# Altium schematic sheet FET.SchDoc (part 2 of 2)
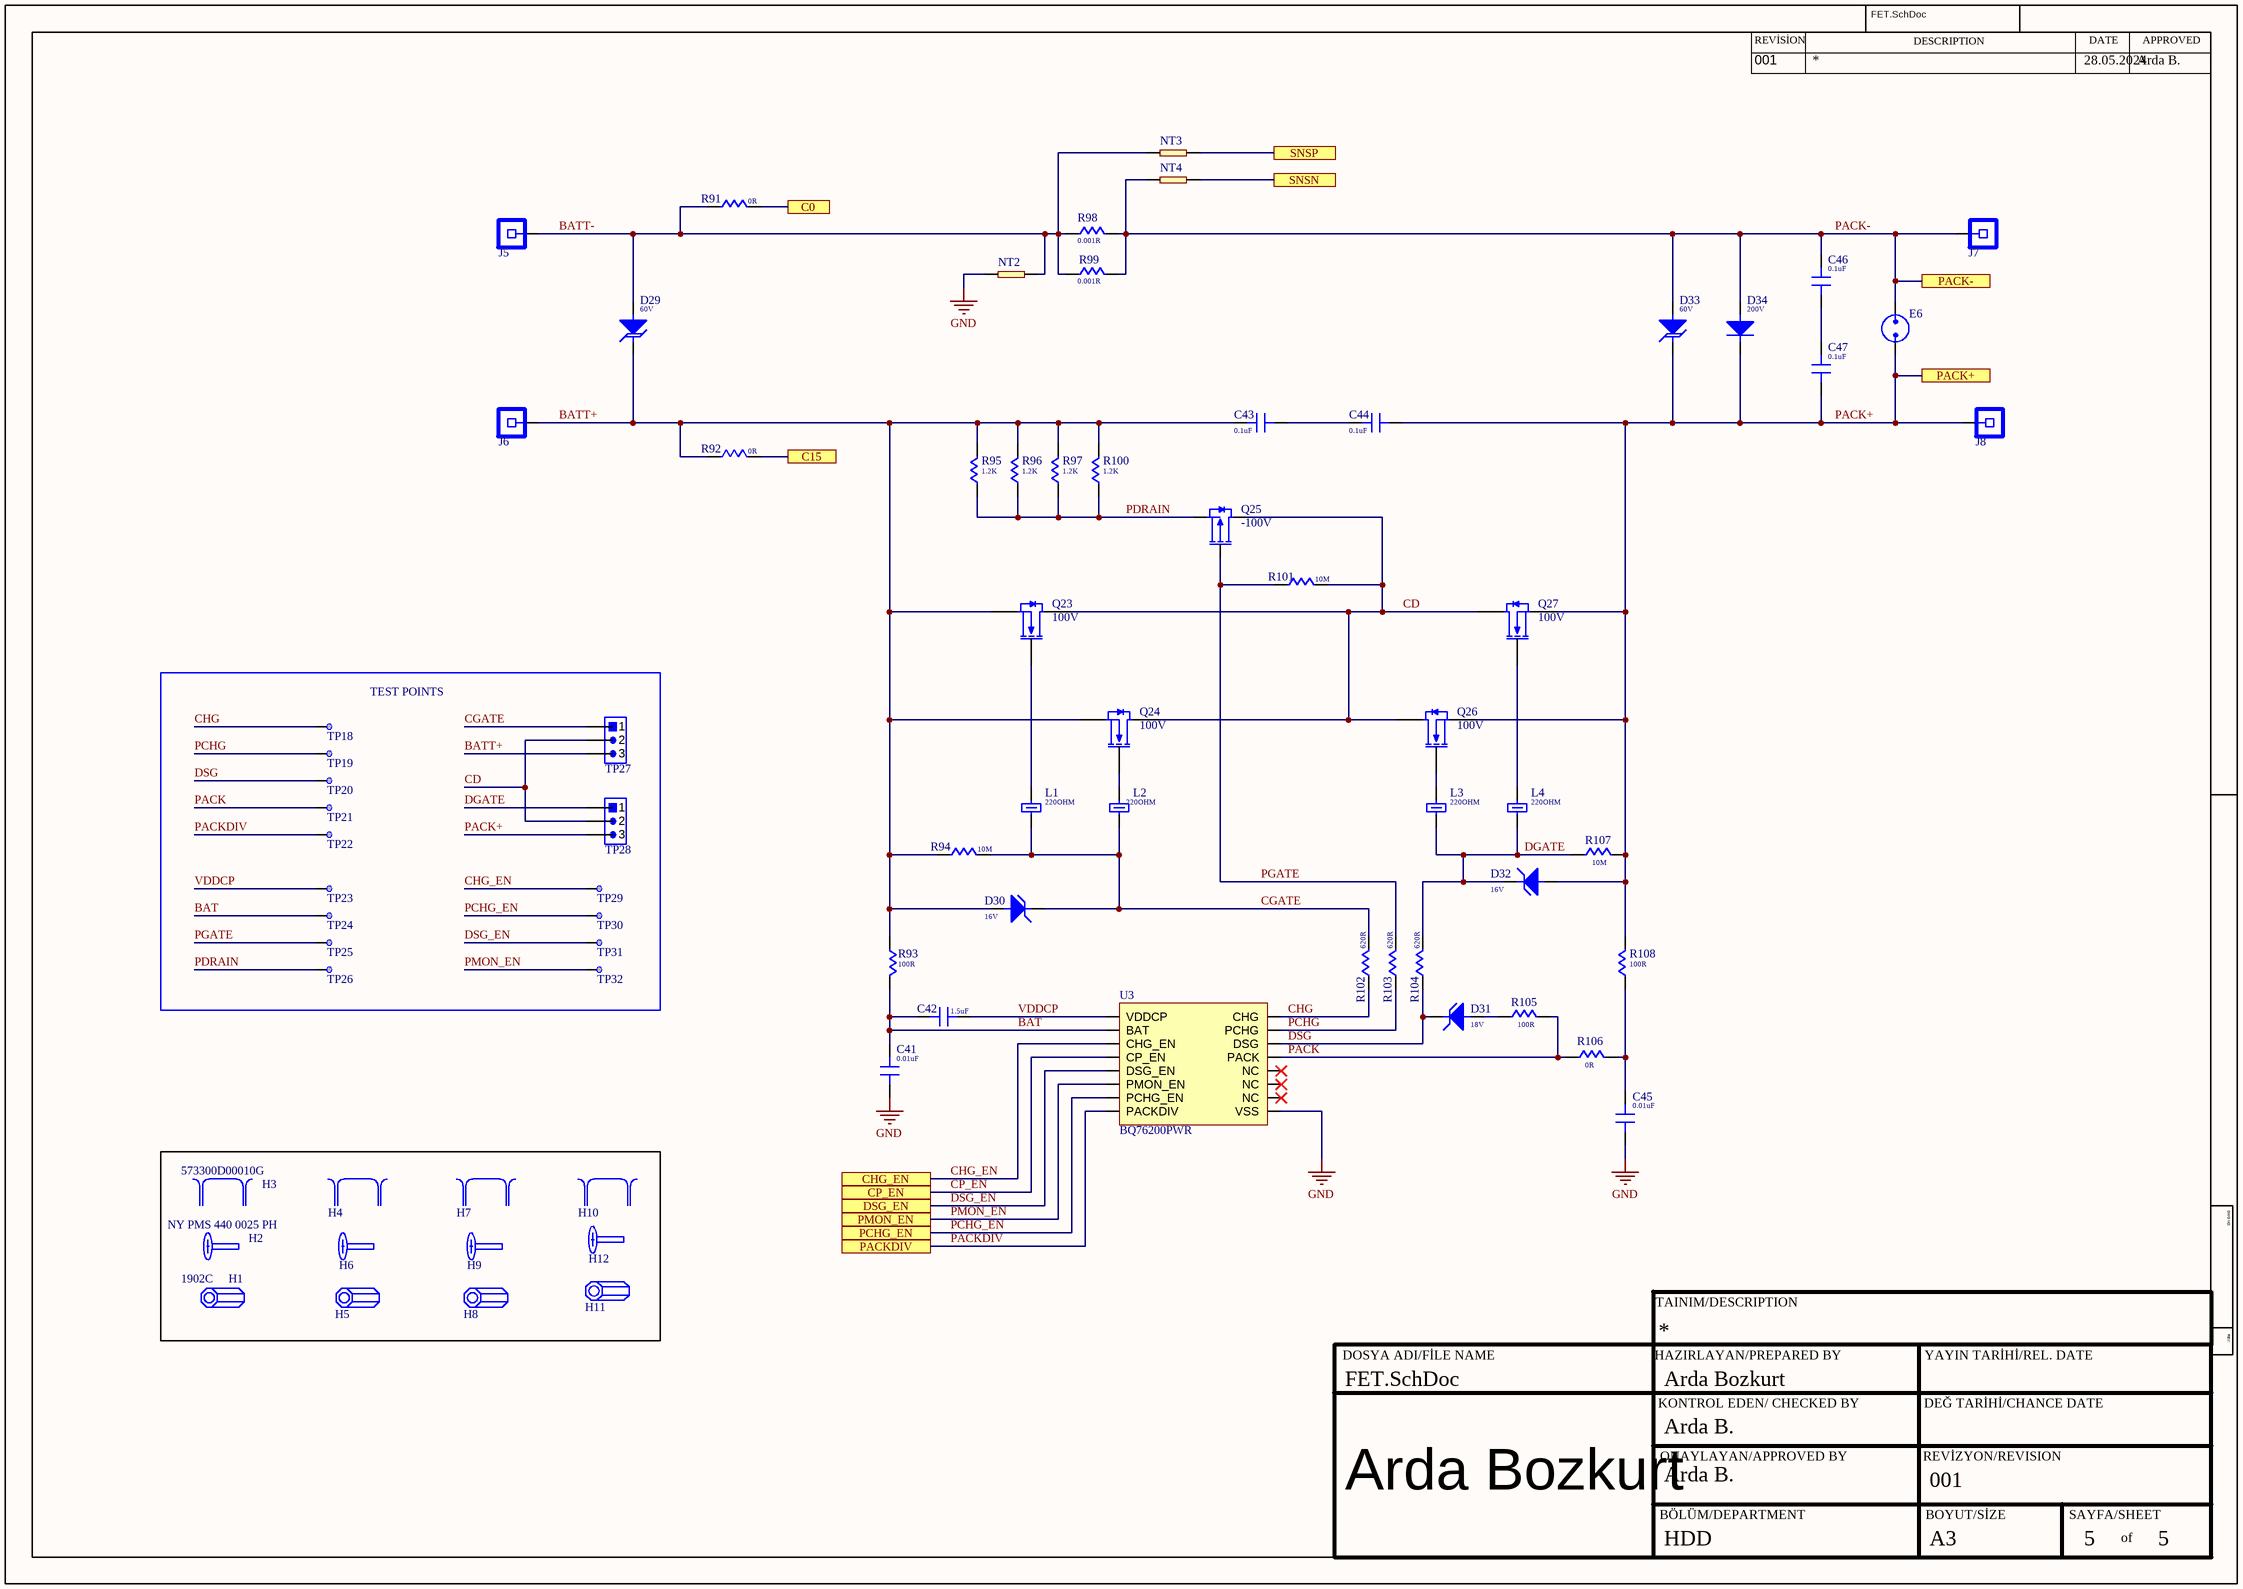
[diagram p1: FET.SchDoc]

## Library data of the parts
C41 C45 = C_0.01uF_0805_100V: Cap Cer 10000PF 100V X7R 0805; Manufacturer: Kyocera AVX; Supplier: Mouser; Supplier Part Number: 581-KGM21NR72A103KT; Manufacturer Part Number: KGM21NR72A103KT; RoHS: No; Category: Ceramic Capacitors; Stock: 110390; Pricing: 1=0,11, 10=0,044, 50=0,044, 100=0,026, 1000=0,019, 10000=0,016 (USD)
C42 = C_1.5uF_0805_25V: 0805 1.5 uF 25 V ±10% Tolerance X7R SMT Multilayer Ceramic Capacitor; Manufacturer: Murata; Voltage Rating: 25V; Supplier: Mouser; Supplier Part Number: 81-GRM21BR71E155KA8L; Manufacturer Part Number: GRM21BR71E155KA88L; RoHS: Yes; Category: Ceramic Capacitors; Stock: 48189; Pricing: 1=0,49, 10=0,245, 50=0,245, 100=0,157, 1000=0,129, 10000=0,085 (USD); Mounting Technology: Surface Mount; Case/Package: 0805; Case Code (Imperial): 0805; Case Code (Metric): 2012; Min Operating Temperature: -55°C; Max Operating Temperature: 125°C; Tolerance: 10%; Dielectric: X7R; Packaging: Tape and Reel; Voltage Rating (DC): 25V; Package Quantity: 1; Termination: SMD/SMT; Voltage: 25V; Series: GRM; Construction: Flat; Length: 2mm; Width: 0.049inch; Height: 1.25mm; Thickness: 0.053inch; Depth: 1.25mm; Radiation Hardening: No; Lead Free: Lead Free; RoHS Compliant: Yes; ComponentLink1URL: https://datasheet.ciiva.com/172/product-172215.pdf?src-supplier=Digikey; ComponentLink1Description: https://datasheet.ciiva.com/172/product-172215.pdf?src-supplier=Digikey; ComponentLink2URL: https://datasheet.ciiva.com/172/product-172214.pdf?src-supplier=Digikey; ComponentLink2Description: https://datasheet.ciiva.com/172/product-172214.pdf?src-supplier=Digikey; ComponentLink3URL: https://datasheet.ciiva.com/3778/131grm21br71e155ka8823-3778948.pdf?src-supplier=Arrow+Electronics; ComponentLink3Description: https://datasheet.ciiva.com/3778/131grm21br71e155ka8823-3778948.pdf?src-supplier=Arrow+Electronics; ComponentLink4URL: https://datasheet.ciiva.com/29534/partnumbering-e-01-29534267.pdf?src-supplier=Digikey; ComponentLink4Description: https://datasheet.ciiva.com/29534/partnumbering-e-01-29534267.pdf?src-supplier=Digikey; ComponentLink5URL: https://datasheet.ciiva.com/11615/product-11615739.pdf?src-supplier=Avnet; ComponentLink5Description: https://datasheet.ciiva.com/11615/product-11615739.pdf?src-supplier=Avnet; ComponentLink6URL: https://datasheet.ciiva.com/16219/l0005e-16219125.pdf?src-supplier=Future+Electronics; ComponentLink6Description: https://datasheet.ciiva.com/16219/l0005e-16219125.pdf?src-supplier=Future+Electronics
C43 C44 C46 C47 = C_0.1uF_0603_100V: Multilayer Ceramic Capacitor, 0.1 uF, 100 V, ± 10%, X7R, 0603 [1608 Metric]; Manufacturer: Murata; Voltage Rating: 100V; Supplier: Mouser; Supplier Part Number: 81-GRM188R72A104KA35; Manufacturer Part Number: GRM188R72A104KA35D; RoHS: Yes; Category: Ceramic Capacitors; Stock: 809956; Pricing: 1=0,2, 10=0,086, 50=0,086, 100=0,05, 1000=0,043, 10000=0,035 (USD); Mounting Technology: Surface Mount; Case/Package: 0603; Weight: 0.000222oz; Case Code (Imperial): 0603; Case Code (Metric): 1608; Material: Ceramic; Min Operating Temperature: -55°C; Max Operating Temperature: 125°C; Tolerance: 10%; Dielectric: X7R; Voltage Rating (DC): 100V; Packaging: Tape and Reel; Package Quantity: 1; Termination: SMD/SMT; Voltage: 100V; Series: GRM; Construction: Flat; Length: 1.6mm; Width: 0.031inch; Height: 0.8mm; Thickness: 0.035inch; Depth: 0.8mm; Size: 0.8mm; Radiation Hardening: No; Reach SVHC Compliant: No; RoHS Compliant: Yes; Lead Free: 5697LeadFree; ComponentLink1URL: https://datasheet.ciiva.com/18100/getdatasheetpartid-27818-18100710.pdf?src-supplier=Verical; ComponentLink1Description: https://datasheet.ciiva.com/18100/getdatasheetpartid-27818-18100710.pdf?src-supplier=Verical; ComponentLink2URL: https://datasheet.ciiva.com/22703/1747473-22703345.pdf?src-supplier=Element14; ComponentLink2Description: https://datasheet.ciiva.com/22703/1747473-22703345.pdf?src-supplier=Element14; ComponentLink3URL: https://datasheet.ciiva.com/34302/1857815-34302863.pdf?src-supplier=Jameco; ComponentLink3Description: https://datasheet.ciiva.com/34302/1857815-34302863.pdf?src-supplier=Jameco; ComponentLink4URL: https://datasheet.ciiva.com/11787/0900766b80ef921d-11787064.pdf?src-supplier=Rs; ComponentLink4Description: https://datasheet.ciiva.com/11787/0900766b80ef921d-11787064.pdf?src-supplier=Rs; ComponentLink5URL: https://datasheet.ciiva.com/29201/451984-da-01-en-vs-kondensator-0603-29201725.pdf?src-supplier=Conrad; ComponentLink5Description: https://datasheet.ciiva.com/29201/451984-da-01-en-vs-kondensator-0603-29201725.pdf?src-supplier=Conrad; ComponentLink6URL: https://datasheet.ciiva.com/7937/1747473-7937676.pdf?src-supplier=Element14; ComponentLink6Description: https://datasheet.ciiva.com/7937/1747473-7937676.pdf?src-supplier=Element14; ComponentLink7URL: https://datasheet.ciiva.com/135/partnumbering-e-01-135140.pdf?src-supplier=Digikey; ComponentLink7Description: https://datasheet.ciiva.com/135/partnumbering-e-01-135140.pdf?src-supplier=Digikey; ComponentLink8URL: https://datasheet.ciiva.com/135/partnumbering-e-01-135139.pdf?src-supplier=Digikey; ComponentLink8Description: https://datasheet.ciiva.com/135/partnumbering-e-01-135139.pdf?src-supplier=Digikey; ComponentLink9URL: https://datasheet.ciiva.com/135/partnumbering-e-01-135141.pdf?src-supplier=Digikey; ComponentLink9Description: https://datasheet.ciiva.com/135/partnumbering-e-01-135141.pdf?src-supplier=Digikey; ComponentLink10URL: https://datasheet.ciiva.com/16382/product-16382965.pdf?src-supplier=Future+Electronics; ComponentLink10Description: https://datasheet.ciiva.com/16382/product-16382965.pdf?src-supplier=Future+Electronics
D29 D33 = D_TVS_60V-SMC: Diode TVS Single Uni-Dir 6V 1.5KW 2-Pin DO-214AB; Manufacturer: Littelfuse; Manufacturer Part Number: SMCJ6.0A; Direction: Unidirectional; Min Breakdown Voltage: 6.67V; Peak Pulse Current: 145.7A; Test Current: 10mA; Breakdown Voltage: 66.7V; Max Breakdown Voltage: 7.37V; Max Power Dissipation: 6.5W; Max Surge Current: 15.5A; Clamping Voltage: 96.8V; Number of Channels: 1; Leakage Current: 800uA; Clamping Voltage-Max: 10.3V; Power Line Protection: No; Diode Type: ZENER; Supplier: Farnell; Supplier Part Number: 4060218; RoHS: Yes; Category: TVS Diodes; Stock: 2678; Pricing: 1=0,5, 10=0,428, 100=0,298, 500=0,233, 1000=0,22, 5000=0,206 (EUR); Mounting Technology: Surface Mount; Case/Package: DO-214AB; Pins: 2; Weight: 0.007408oz; Min Operating Temperature: -55°C; Max Operating Temperature: 150°C; Packaging: Tape and Reel; Reverse Standoff Voltage: 6V; Peak Pulse Power: 1.5kW; Polarity: Unidirectional; Power Dissipation: 1.5kW; Termination: SMD/SMT; Voltage Rating (DC): 6V; Package Quantity: 3000; Operating Supply Voltage: 6V; Series: SMCJ; Reverse Breakdown Voltage: 6.67V; Number of Unidirectional Channels: 1; Number of Elements: 1; Length: 8.13mm; Width: 6.22mm; Height: 2.62mm; Reach SVHC Compliant: No; Lead Free: Lead Free; RoHS Compliant: Yes; ComponentLink1URL: https://datasheet.ciiva.com/18549/littelfuse-tvs-diode-smcj-datasheet-pdf-18549239.pdf?src-supplier=Digikey; ComponentLink1Description: https://datasheet.ciiva.com/18549/littelfuse-tvs-diode-smcj-datasheet-pdf-18549239.pdf?src-supplier=Digikey; ComponentLink2URL: https://datasheet.ciiva.com/22685/607636-22685525.pdf?src-supplier=Element14; ComponentLink2Description: https://datasheet.ciiva.com/22685/607636-22685525.pdf?src-supplier=Element14; ComponentLink3URL: https://datasheet.ciiva.com/16215/littelfuse-tvs-diode-smcj-16215483.pdf?src-supplier=Future+Electronics; ComponentLink3Description: https://datasheet.ciiva.com/16215/littelfuse-tvs-diode-smcj-16215483.pdf?src-supplier=Future+Electronics; ComponentLink4URL: https://datasheet.ciiva.com/332/littelfuse-tvs-diode-smcj-datasheet-pdf-332130.pdf?src-supplier=Digikey; ComponentLink4Description: https://datasheet.ciiva.com/332/littelfuse-tvs-diode-smcj-datasheet-pdf-332130.pdf?src-supplier=Digikey; ComponentLink5URL: https://datasheet.ciiva.com/332/littelfuse-tvs-diode-smcj-datasheet-pdf-332131.pdf?src-supplier=Digikey; ComponentLink5Description: https://datasheet.ciiva.com/332/littelfuse-tvs-diode-smcj-datasheet-pdf-332131.pdf?src-supplier=Digikey; ComponentLink6URL: https://datasheet.ciiva.com/332/littelfuse-tvs-diode-smcj-datasheet-pdf-332129.pdf?src-supplier=Digikey; ComponentLink6Description: https://datasheet.ciiva.com/332/littelfuse-tvs-diode-smcj-datasheet-pdf-332129.pdf?src-supplier=Digikey; ComponentLink7URL: https://datasheet.ciiva.com/332/littelfuse-tvs-diode-smcj-datasheet-pdf-332202.pdf?src-supplier=Digikey; ComponentLink7Description: https://datasheet.ciiva.com/332/littelfuse-tvs-diode-smcj-datasheet-pdf-332202.pdf?src-supplier=Digikey; ComponentLink8URL: https://datasheet.ciiva.com/332/littelfuse-tvs-diode-smcj-datasheet-pdf-332203.pdf?src-supplier=Digikey; ComponentLink8Description: https://datasheet.ciiva.com/332/littelfuse-tvs-diode-smcj-datasheet-pdf-332203.pdf?src-supplier=Digikey; ComponentLink9URL: https://datasheet.ciiva.com/332/littelfuse-tvs-diode-smcj-datasheet-pdf-332201.pdf?src-supplier=Digikey; ComponentLink9Description: https://datasheet.ciiva.com/332/littelfuse-tvs-diode-smcj-datasheet-pdf-332201.pdf?src-supplier=Digikey
D30 D32 = D_ZENER_16V_SOD323: Zener Diode, 16V, 0.2W, Sod-323 Rohs Compliant: Yes |Diodes Inc. MMSZ5246BS-7-F; Manufacturer: Diodes Zetex; Supplier: Mouser; Supplier Part Number: 621-MMSZ5246BS-7-F; Manufacturer Part Number: MMSZ5246BS-7-F; RoHS: Yes; Category: Zener Diodes; Stock: 7167; Pricing: 1=0,26, 10=0,172, 50=0,172, 100=0,076, 1000=0,054, 10000=0,036 (USD); ComponentLink1URL: https://datasheet.ciiva.com/15142/getdatasheetpartid-61109-15142282.pdf?src-supplier=Verical; ComponentLink1Description: https://datasheet.ciiva.com/15142/getdatasheetpartid-61109-15142282.pdf?src-supplier=Verical; ComponentLink2URL: https://datasheet.ciiva.com/16463/ds31038-16463243.pdf?src-supplier=Future+Electronics; ComponentLink2Description: https://datasheet.ciiva.com/16463/ds31038-16463243.pdf?src-supplier=Future+Electronics; ComponentLink3URL: https://datasheet.ciiva.com/10640/ds31038-10640190.pdf?src-supplier=Avnet; ComponentLink3Description: https://datasheet.ciiva.com/10640/ds31038-10640190.pdf?src-supplier=Avnet
D31 = D_ZENER_18V_SOD323: Diode Zener Single 18V 5% 200mW Automotive 2-Pin SOD-323 T/R; Manufacturer: Diodes; Supplier: Mouser; Supplier Part Number: 621-MMSZ5248BS-F; Manufacturer Part Number: MMSZ5248BS-7-F; RoHS: Yes; Category: Zener Diodes; Stock: 6211; Pricing: 1=0,33, 10=0,22, 50=0,22, 100=0,094, 1000=0,072, 10000=0,05 (USD); ComponentLink1URL: https://datasheet.ciiva.com/8347/ds18010-8347928.pdf?src-supplier=Avnet; ComponentLink1Description: https://datasheet.ciiva.com/8347/ds18010-8347928.pdf?src-supplier=Avnet; ComponentLink2URL: https://datasheet.ciiva.com/892/ds31038-892342.pdf?src-supplier=Digikey; ComponentLink2Description: https://datasheet.ciiva.com/892/ds31038-892342.pdf?src-supplier=Digikey; ComponentLink3URL: https://datasheet.ciiva.com/892/ds31038-892343.pdf?src-supplier=Digikey; ComponentLink3Description: https://datasheet.ciiva.com/892/ds31038-892343.pdf?src-supplier=Digikey; ComponentLink4URL: https://datasheet.ciiva.com/892/ds31038-892344.pdf?src-supplier=Digikey; ComponentLink4Description: https://datasheet.ciiva.com/892/ds31038-892344.pdf?src-supplier=Digikey; ComponentLink5URL: https://datasheet.ciiva.com/8025/ds31038-8025788.pdf?src-supplier=Element14; ComponentLink5Description: https://datasheet.ciiva.com/8025/ds31038-8025788.pdf?src-supplier=Element14
D34 = D_GENPURP_200V_DO214AB: Rectifier Diode Switching 200V 3A 20ns 2-Pin SMC T/R / DIODE GEN PURP 200V 3A DO214AB; Manufacturer: Vishay Semiconductors; Forward Voltage: 900mV; Max Reverse Current: 10uA; Polarity: 4901Direction; Max Forward Surge Current (Ifsm): 100A; Element Configuration: 5460ElementConfiguration; Recovery Time: 30ns; Supplier: Mouser; Supplier Part Number: 625-ES3D-E3; Manufacturer Part Number: ES3D-E3/57T; RoHS: Yes; Category: Rectifier Diodes; Stock: 79027; Pricing: 1=0,59, 10=0,48, 50=0,48, 100=0,366, 1000=0,232, 10000=0,174 (USD); Case/Package: 101Case; Pins: 2NUMBER; Min Operating Temperature: -55°C; Max Operating Temperature: 150°C; Current Rating: 3A; Forward Current: 3A; Max Repetitive Reverse Voltage (Vrrm): 200V; Voltage Rating (DC): 200V; Output Current: 3A; Peak Non-Repetitive Surge Current: 100A; Termination: 4890ConnectorType; Current: 3A; Max Surge Current: 100A; Reverse Voltage: 200V; Voltage: 200V; Length: 7.0866mm; Width: 8.13mm; Height: 2.413mm; Radiation Hardening: 5898YesNo; Lead Free: 5697LeadFree; Reach SVHC Compliant: 4187SVHC; ComponentLink1URL: http://datasheet.octopart.com/ES3D-E3-57T-Vishay-datasheet-5333027.pdf?src-supplier=Mouser; ComponentLink1Description: http://datasheet.octopart.com/ES3D-E3-57T-Vishay-datasheet-5333027.pdf?src-supplier=Mouser; ComponentLink2URL: http://datasheet.octopart.com/ES3D-E3-57T-Vishay-datasheet-5333027.pdf?src-supplier=Future+Electronics; ComponentLink2Description: http://datasheet.octopart.com/ES3D-E3-57T-Vishay-datasheet-5333027.pdf?src-supplier=Future+Electronics; ComponentLink3URL: http://datasheet.octopart.com/ES3D-E3-57T-Vishay-datasheet-5333027.pdf?src-supplier=Verical; ComponentLink3Description: http://datasheet.octopart.com/ES3D-E3-57T-Vishay-datasheet-5333027.pdf?src-supplier=Verical; ComponentLink4URL: http://datasheet.octopart.com/ES3D-E3-57T-Vishay-datasheet-5333027.pdf?src-supplier=Digikey; ComponentLink4Description: http://datasheet.octopart.com/ES3D-E3-57T-Vishay-datasheet-5333027.pdf?src-supplier=Digikey; ComponentLink5URL: https://datasheet.octopart.com/ES3D-E3-57T-Vishay-datasheet-33014097.pdf?src-supplier=Farnell; ComponentLink5Description: https://datasheet.octopart.com/ES3D-E3-57T-Vishay-datasheet-33014097.pdf?src-supplier=Farnell; ComponentLink6URL: http://datasheet.octopart.com/ES3D-E3-57T-Vishay-datasheet-5333027.pdf?src-supplier=Avnet; ComponentLink6Description: http://datasheet.octopart.com/ES3D-E3-57T-Vishay-datasheet-5333027.pdf?src-supplier=Avnet; ComponentLink7URL: https://datasheet.octopart.com/ES3D-E3-57T-Vishay-datasheet-5333027.pdf?src-supplier=Newark; ComponentLink7Description: https://datasheet.octopart.com/ES3D-E3-57T-Vishay-datasheet-5333027.pdf?src-supplier=Newark; ComponentLink8URL: https://datasheet.octopart.com/ES3D-E3-57T-Vishay-datasheet-10220666.pdf?src-supplier=Element14; ComponentLink8Description: https://datasheet.octopart.com/ES3D-E3-57T-Vishay-datasheet-10220666.pdf?src-supplier=Element14; ComponentLink9URL: http://datasheet.octopart.com/ES3D-E3-57T-Vishay-datasheet-5333027.pdf?src-supplier=Arrow+Electronics; ComponentLink9Description: http://datasheet.octopart.com/ES3D-E3-57T-Vishay-datasheet-5333027.pdf?src-supplier=Arrow+Electronics; ComponentLink10URL: http://www.farnell.com/datasheets/2237719.pdf?src-supplier=Newark; ComponentLink10Description: http://www.farnell.com/datasheets/2237719.pdf?src-supplier=Newark; ComponentLink11URL: http://datasheet.octopart.com/ES3D-E3-57T-Vishay-datasheet-5333027.pdf?src-supplier=Rutronik; ComponentLink11Description: http://datasheet.octopart.com/ES3D-E3-57T-Vishay-datasheet-5333027.pdf?src-supplier=Rutronik; ComponentLink12URL: https://datasheet.octopart.com/ES3D-E3-57T-Vishay-datasheet-62343674.pdf?src-supplier=TME; ComponentLink12Description: https://datasheet.octopart.com/ES3D-E3-57T-Vishay-datasheet-62343674.pdf?src-supplier=TME; ComponentLink13URL: http://datasheet.octopart.com/ES3D-E3-57T-Vishay-datasheet-5333027.pdf?src-supplier=Quest; ComponentLink13Description: http://datasheet.octopart.com/ES3D-E3-57T-Vishay-datasheet-5333027.pdf?src-supplier=Quest; ComponentLink14URL: http://datasheet.octopart.com/ES3D-E3-57T-Vishay-datasheet-5333027.pdf?src-supplier=TTI; ComponentLink14Description: http://datasheet.octopart.com/ES3D-E3-57T-Vishay-datasheet-5333027.pdf?src-supplier=TTI; ComponentLink15URL: http://datasheet.octopart.com/ES3D-E3-57T-Vishay-datasheet-5333027.pdf?src-supplier=LCSC; ComponentLink15Description: http://datasheet.octopart.com/ES3D-E3-57T-Vishay-datasheet-5333027.pdf?src-supplier=LCSC
E6 = E_Spark_Gap: Spark Gap
H1 H5 H8 H11 = HEX STANDOFF: Transistor: 2xN-MOSFET; unipolar; 20V; 1.1A; 0.235ohm; 420mW; -55+150 deg.C; SMD; SC70-6; Manufacturer: Vishay; Manufacturer Part Number: SI1902CDL-T1-GE3; Supplier: Mouser; Supplier Part Number: 78-SI1902CDL-T1-GE3; RoHS: Yes; Category: MOSFETs; Stock: 101273; Pricing: 1=0,43, 10=0,325, 50=0,325, 100=0,177, 1000=0,119, 10000=0,101 (USD); ComponentLink1URL: https://datasheet.ciiva.com/24010/si1902cdl-256522-24010888.pdf?src-supplier=Mouser; ComponentLink1Description: https://datasheet.ciiva.com/24010/si1902cdl-256522-24010888.pdf?src-supplier=Mouser; ComponentLink2URL: https://datasheet.ciiva.com/29589/si1902cdl-29589781.pdf?src-supplier=Digikey; ComponentLink2Description: https://datasheet.ciiva.com/29589/si1902cdl-29589781.pdf?src-supplier=Digikey
H2 H6 H9 H12 = MACHINE SCREW PAN PHILLIPS 4-40: Manufacturer: Building Fasteners; Supplier: Digikey; Supplier Part Number: H542-ND; Manufacturer Part Number: NY PMS 440 0025 PH; RoHS: No; Category: Screws and Fasteners; Stock: 49239; Pricing: 100=0,1653, 1000=0,13225 (USD); ComponentLink1URL: http://www.fasnetdirect.com/refguide/Nylpanms.pdf?src-supplier=Digikey; ComponentLink1Description: http://www.fasnetdirect.com/refguide/Nylpanms.pdf?src-supplier=Digikey
H3 H4 H7 H10 = Heatsink: TO-226 Surface Mount 18.00 C/W Thermal Resistance D2 Semiconductor Heat Sink; Manufacturer: Aavid Thermalloy; Finish: Tin; Shape: Rectangular; Natural Thermal Resistance: 18°C/W; Thermal Resistance @ Forced Air Flow (100 LFM): 10°C/W; Supplier: Mouser; Supplier Part Number: 532-573300D00010G; Manufacturer Part Number: 573300D00010G; RoHS: Yes; Category: Heat Sinks; Stock: 19952; Pricing: 1=0,9, 10=0,797, 50=0,797, 100=0,787, 1000=0,675, 10000=0,659 (USD); Mounting Technology: Surface Mount,PCB; Case/Package: TO-263; Material: Copper,Tin,Matte; Type: Passive; Package Quantity: 250; Packaging: Tape and Reel; Length: 26.16mm; Width: 26.16mm; Height: 10.16mm; Depth: 12.7mm; Height Off Base: 0.4inch; Radiation Hardening: No; RoHS Compliant: Yes; Lead Free: Lead Free; Reach SVHC Compliant: No; ComponentLink1URL: https://datasheet.ciiva.com/17/aavid-board-level-heatsinks-catalog-17057.pdf?src-supplier=Digikey; ComponentLink1Description: https://datasheet.ciiva.com/17/aavid-board-level-heatsinks-catalog-17057.pdf?src-supplier=Digikey; ComponentLink2URL: https://datasheet.ciiva.com/19459/2033463202-19459463.pdf?src-supplier=Jameco; ComponentLink2Description: https://datasheet.ciiva.com/19459/2033463202-19459463.pdf?src-supplier=Jameco; ComponentLink3URL: https://datasheet.ciiva.com/1004/aavid-board-level-heatsinks-catalog-1004051.pdf?src-supplier=Digikey; ComponentLink3Description: https://datasheet.ciiva.com/1004/aavid-board-level-heatsinks-catalog-1004051.pdf?src-supplier=Digikey; ComponentLink4URL: https://datasheet.ciiva.com/1004/aavid-board-level-heatsinks-catalog-1004052.pdf?src-supplier=Digikey; ComponentLink4Description: https://datasheet.ciiva.com/1004/aavid-board-level-heatsinks-catalog-1004052.pdf?src-supplier=Digikey; ComponentLink5URL: https://datasheet.ciiva.com/15182/getdatasheetpartid-110609-15182557.pdf?src-supplier=Verical; ComponentLink5Description: https://datasheet.ciiva.com/15182/getdatasheetpartid-110609-15182557.pdf?src-supplier=Verical; ComponentLink6URL: https://datasheet.ciiva.com/8004/1581390-8004589.pdf?src-supplier=Element14; ComponentLink6Description: https://datasheet.ciiva.com/8004/1581390-8004589.pdf?src-supplier=Element14
J5-J8 = CONN_LUG: One-hole copper single barrel post lug straight tongue 14 SOL - 4 STR 1/4 (6.4mm) stud hole.; Manufacturer: Panduit; Supplier: Digikey; Supplier Part Number: 298-11858-ND; Manufacturer Part Number: ML4-CY; RoHS: Yes; Category: Terminals; Stock: 1277; Pricing: 1=3,08, 10=2,994, 25=2,9112, 50=2,828, 100=2,7449, 500=2,6617, 1000=2,57852 (USD); ComponentLink1URL: https://datasheet.ciiva.com/13579/c41569-05-259894-13579514.pdf?src-supplier=Mouser; ComponentLink1Description: https://datasheet.ciiva.com/13579/c41569-05-259894-13579514.pdf?src-supplier=Mouser; ComponentLink2URL: https://datasheet.ciiva.com/30261/cmscont-082463-30261378.pdf?src-supplier=Onlinecomponents.com; ComponentLink2Description: https://datasheet.ciiva.com/30261/cmscont-082463-30261378.pdf?src-supplier=Onlinecomponents.com; ComponentLink3URL: https://datasheet.ciiva.com/16062/099037-16062195.pdf?src-supplier=Onlinecomponents.com; ComponentLink3Description: https://datasheet.ciiva.com/16062/099037-16062195.pdf?src-supplier=Onlinecomponents.com; ComponentLink4URL: https://datasheet.ciiva.com/29672/c41569-05-29672890.pdf?src-supplier=Digikey; ComponentLink4Description: https://datasheet.ciiva.com/29672/c41569-05-29672890.pdf?src-supplier=Digikey
L1-L4 = L_FB_220OHM_0603: Ferrite Beads Multi-Layer 220Ohm 25% 100MHz 2.5A 40mOhm DCR 0603 Paper T/R; Manufacturer: Murata; Material: Steel,Ferrite; Impedance: 220R; DC Resistance (DCR): 40mR; Number of Lines: 1; Supplier: Mouser; Supplier Part Number: 81-BLM18SG221TN1D; Manufacturer Part Number: BLM18SG221TN1D; RoHS: Yes; Category: Ferrite Beads and Chips; Stock: 535751; Pricing: 1=0,13, 10=0,071, 50=0,071, 100=0,049, 1000=0,036, 10000=0,03 (USD); Case/Package: 0603; Pins: 2; Core Material: Ferrite; Case Code (Metric): 1608; Case Code (Imperial): 0603; Weight: 7.1E-05oz; Min Operating Temperature: -55°C; Max Operating Temperature: 125°C; Tolerance: 25%; Max DC Current: 2.5A; Package Quantity: 1; Max Current Rating: 2.5A; Packaging: Tape and Reel; Current Rating: 2.5A; Termination: SMD/SMT; Test Frequency: 100MHz; DC Current: 2.5A; Number of Circuits: 1; Series: BLM18S; DC Resistance-Max: 40mR; RMS Current (Irms): 2.5A; ESR: 40mR; Length: 1.6mm; Width: 0.8mm; Height: 0.8mm; Depth: 0.95mm; Radiation Hardening: No; Reach SVHC Compliant: No; Lead Free: Lead Free; RoHS Compliant: Yes; ComponentLink1URL: https://datasheet.ciiva.com/1561/c31e-1561456.pdf?src-supplier=Newark; ComponentLink1Description: https://datasheet.ciiva.com/1561/c31e-1561456.pdf?src-supplier=Newark; ComponentLink2URL: https://datasheet.ciiva.com/41449/001171724-da-01-en-chip-drossel0603-220r-2500ma-1-6x0-8mm-41449352.pdf?src-supplier=Conrad; ComponentLink2Description: https://datasheet.ciiva.com/41449/001171724-da-01-en-chip-drossel0603-220r-2500ma-1-6x0-8mm-41449352.pdf?src-supplier=Conrad; ComponentLink3URL: https://datasheet.ciiva.com/41449/001172313-da-01-en-drossel-0603-220r-21-6x0-8mm-10000st-41449677.pdf?src-supplier=Conrad; ComponentLink3Description: https://datasheet.ciiva.com/41449/001172313-da-01-en-drossel-0603-220r-21-6x0-8mm-10000st-41449677.pdf?src-supplier=Conrad; ComponentLink4URL: https://datasheet.ciiva.com/14122/blm-series-eng-tds-14122910.pdf?src-supplier=Distrelec; ComponentLink4Description: https://datasheet.ciiva.com/14122/blm-series-eng-tds-14122910.pdf?src-supplier=Distrelec; ComponentLink5URL: https://datasheet.ciiva.com/8508/l0110s0100blm18s-8508310.pdf?src-supplier=Avnet; ComponentLink5Description: https://datasheet.ciiva.com/8508/l0110s0100blm18s-8508310.pdf?src-supplier=Avnet; ComponentLink6URL: https://datasheet.ciiva.com/8021/5151-8021517.pdf?src-supplier=Element14; ComponentLink6Description: https://datasheet.ciiva.com/8021/5151-8021517.pdf?src-supplier=Element14; ComponentLink7URL: https://datasheet.ciiva.com/8021/5151-8021519.pdf?src-supplier=Element14; ComponentLink7Description: https://datasheet.ciiva.com/8021/5151-8021519.pdf?src-supplier=Element14; ComponentLink8URL: https://datasheet.ciiva.com/1012/l0110s0100blm18s-1012627.pdf?src-supplier=Digikey; ComponentLink8Description: https://datasheet.ciiva.com/1012/l0110s0100blm18s-1012627.pdf?src-supplier=Digikey; ComponentLink9URL: https://datasheet.ciiva.com/1012/l0110s0100blm18s-1012626.pdf?src-supplier=Digikey; ComponentLink9Description: https://datasheet.ciiva.com/1012/l0110s0100blm18s-1012626.pdf?src-supplier=Digikey; ComponentLink10URL: https://datasheet.ciiva.com/1012/l0110s0100blm18s-1012628.pdf?src-supplier=Digikey; ComponentLink10Description: https://datasheet.ciiva.com/1012/l0110s0100blm18s-1012628.pdf?src-supplier=Digikey; ComponentLink11URL: https://datasheet.ciiva.com/16204/l0110s0100blm18s-16204029.pdf?src-supplier=Future+Electronics; ComponentLink11Description: https://datasheet.ciiva.com/16204/l0110s0100blm18s-16204029.pdf?src-supplier=Future+Electronics
NT2 = NET_TİE_2: Single point connection between nets.
NT3 NT4 = NET_TİE_3: Single point connection between nets.
Q23 Q24 Q26 Q27 = Q_MOSFET_100V_TO363: 100-V, N channel NexFET™ power MOSFET, single D2PAK, 2.4 mOhm 3-DDPAK/TO-263 -55 to 175; Manufacturer: Texas Instruments; Supplier: Mouser; Supplier Part Number: 595-CSD19536KTT; Manufacturer Part Number: CSD19536KTT; RoHS: Yes; Category: MOSFETs; Stock: 1933; Pricing: 1=4,44, 10=3,73, 50=3,73, 100=3,02, 1000=2,29, 10000=2,16 (USD); ComponentLink1URL: http://www.ti.com/lit/gpn/csd19536ktt?src-supplier=Mouser; ComponentLink1Description: http://www.ti.com/lit/gpn/csd19536ktt?src-supplier=Mouser; ComponentLink2URL: http://www.ti.com/general/docs/lit/getliterature.tsp?genericPartNumber=CSD19536KTT&&fileType=pdf&src-supplier=Avnet; ComponentLink2Description: http://www.ti.com/general/docs/lit/getliterature.tsp?genericPartNumber=CSD19536KTT&&fileType=pdf&src-supplier=Avnet; ComponentLink3URL: http://www.ti.com/lit/ds/symlink/csd19536ktt.pdf?src-supplier=Digikey; ComponentLink3Description: http://www.ti.com/lit/ds/symlink/csd19536ktt.pdf?src-supplier=Digikey; ComponentLink4URL: http://www.ti.com/general/docs/suppproductinfo.tsp?distId=10&amp;gotoUrl=http%3A%2F%2Fwww.ti.com%2Flit%2Fgpn%2Fcsd19536ktt&src-supplier=Digikey; ComponentLink4Description: http://www.ti.com/general/docs/suppproductinfo.tsp?distId=10&amp;gotoUrl=http%3A%2F%2Fwww.ti.com%2Flit%2Fgpn%2Fcsd19536ktt&src-supplier=Digikey
Q25 = Q_MOSFET_100V_SOT23-3_1: P-Channel 100 V 1 Ohm Surface Mount Enhancement Mode MOSFET - SOT-23; Manufacturer: Diodes Zetex; Current Rating: -500mA; Supplier: Future Electronics; Supplier Part Number: 3181252; Manufacturer Part Number: ZXMP10A13FTA; RoHS: Yes; Category: MOSFETs; Stock: 1053000; Pricing: 3000=0,16, 6000=0,157, 9000=0,155, 12000=0,154, 15000=0,15 (USD); Lead Free: 5697LeadFree; ComponentLink1URL: https://datasheet.ciiva.com/6383/zxmp10a13f-6383089.pdf?src-supplier=Digikey; ComponentLink1Description: https://datasheet.ciiva.com/6383/zxmp10a13f-6383089.pdf?src-supplier=Digikey; ComponentLink2URL: https://datasheet.ciiva.com/11175/zxmp10a13f-11175011.pdf?src-supplier=Avnet; ComponentLink2Description: https://datasheet.ciiva.com/11175/zxmp10a13f-11175011.pdf?src-supplier=Avnet; ComponentLink3URL: https://datasheet.ciiva.com/17097/zxmp10a13fta-17097946.pdf?src-supplier=Allied+Electronics; ComponentLink3Description: https://datasheet.ciiva.com/17097/zxmp10a13fta-17097946.pdf?src-supplier=Allied+Electronics; ComponentLink4URL: https://datasheet.ciiva.com/16387/zxmp10a13f-16387581.pdf?src-supplier=Future+Electronics; ComponentLink4Description: https://datasheet.ciiva.com/16387/zxmp10a13f-16387581.pdf?src-supplier=Future+Electronics; ComponentLink5URL: https://datasheet.ciiva.com/22712/1915646-22712428.pdf?src-supplier=Element14; ComponentLink5Description: https://datasheet.ciiva.com/22712/1915646-22712428.pdf?src-supplier=Element14; ComponentLink6URL: https://datasheet.ciiva.com/6383/zxmp10a13f-6383087.pdf?src-supplier=Digikey; ComponentLink6Description: https://datasheet.ciiva.com/6383/zxmp10a13f-6383087.pdf?src-supplier=Digikey
R91 R92 R106 = R_0OHM_1/10W_0603: Zero Ohm Resistor, Jumper, 0603 [1608 Metric], Thick Film, 330 mW, 5 A, Surface Mount; Manufacturer: Vishay Dale; Manufacturer Part Number: CRCW06030000Z0EAHP; Power Rating: 250mW; Voltage Rating: 75V; Temperature Coefficient: 0ppm/°C; Supplier: Mouser; Supplier Part Number: 71-CRCW06030000Z0EAH; RoHS: Yes; Category: Chip SMD Resistors; Stock: 1018937; Pricing: 1=0,14, 10=0,068, 50=0,068, 100=0,03, 1000=0,021, 10000=0,014 (USD); Case/Package: 0603; Pins: 2; Contact Plating: Tin; Case Code (Metric): 1608; Case Code (Imperial): 0603; Weight: 7.1E-05oz; Min Operating Temperature: -55°C; Max Operating Temperature: 155°C; Packaging: Tape and Reel; Resistor Type: Thick Film; Number of Terminations: 2; Termination: SMD/SMT; Max Power Dissipation: 250mW; Features: Automotive AEC-Q200; Series: CRCW-HP; Voltage Rating (DC): 75V; Package Quantity: 5000; Technology: THICK FILM; Construction: Rectangular; Length: 1.6mm; Width: 0.033inch; Height: 0.45mm; Depth: 0.85mm; Ratings: AEC-Q200; Radiation Hardening: No; Lead Free: 5697LeadFree; RoHS Compliant: Yes; Reach SVHC Compliant: Unknown; Military Standard: Not; ComponentLink1URL: https://datasheet.ciiva.com/8340/crcwhpe3-8340198.pdf?src-supplier=Avnet; ComponentLink1Description: https://datasheet.ciiva.com/8340/crcwhpe3-8340198.pdf?src-supplier=Avnet; ComponentLink2URL: https://datasheet.ciiva.com/16430/crcwhpe3-16430059.pdf?src-supplier=Future+Electronics; ComponentLink2Description: https://datasheet.ciiva.com/16430/crcwhpe3-16430059.pdf?src-supplier=Future+Electronics; ComponentLink3URL: https://datasheet.ciiva.com/2472/crcwhpe3-2472034.pdf?src-supplier=Digikey; ComponentLink3Description: https://datasheet.ciiva.com/2472/crcwhpe3-2472034.pdf?src-supplier=Digikey; ComponentLink4URL: https://datasheet.ciiva.com/2472/crcwhpe3-2472035.pdf?src-supplier=Digikey; ComponentLink4Description: https://datasheet.ciiva.com/2472/crcwhpe3-2472035.pdf?src-supplier=Digikey; ComponentLink5URL: https://datasheet.ciiva.com/2472/crcwhpe3-2472033.pdf?src-supplier=Digikey; ComponentLink5Description: https://datasheet.ciiva.com/2472/crcwhpe3-2472033.pdf?src-supplier=Digikey; ComponentLink6URL: https://datasheet.ciiva.com/28621/1912814-28621358.pdf?src-supplier=Element14; ComponentLink6Description: https://datasheet.ciiva.com/28621/1912814-28621358.pdf?src-supplier=Element14
R93 R108 = R_100OHM_%1_1/10W_0603: SMD Chip Resistor, 100 Ohm, ± 1%, 100 mW, 0603 [1608 Metric], Thick Film, General Purpose; Manufacturer: Vishay Dale; Power Rating: 100mW; Temperature Coefficient: 100ppm/°C; Voltage Rating (DC): 75V; Supplier: Mouser; Supplier Part Number: 71-CRCW0603-100-E3; Manufacturer Part Number: CRCW0603100RFKEA; RoHS: Yes; Category: Chip SMD Resistors; Stock: 279903; Pricing: 1=0,1, 10=0,017, 50=0,017, 100=0,01, 1000=0,007, 10000=0,004 (USD); Case/Package: 0603; Pins: 2NUMBER; Weight: 7.1E-05oz; Case Code (Metric): 1608; Case Code (Imperial): 0603; Min Operating Temperature: -55°C; Max Operating Temperature: 155°C; Tolerance: 1%; Packaging: Tape and Reel; Resistor Type: Thick Film; Package Quantity: 10; Voltage Rating: 75V; Number of Terminations: 2; Termination: SMD/SMT; Max Power Dissipation: 100mW; Features: Automotive AEC-Q200; Series: CRCW; Resistance Tolerance: 1%; Construction: Rectangular; Length: 1.55mm; Width: 0.033inch; Height: 0.02inch; Depth: 0.85mm; Ratings: AEC-Q200; Lead Free: 5697LeadFree; RoHS Compliant: Yes; Reach SVHC Compliant: Unknown; Military Standard: Not
R94 R101 R107 = R_10M_%1_1/10W_0603: SMD Chip Resistor, 10 MOhm, ± 1%, 100 mW, 0603 [1608 Metric], Thick Film, General Purpose; Manufacturer: Vishay; Power Rating: 100mW; Voltage Rating: 75V; Temperature Coefficient: 100ppm/°C; Supplier: Mouser; Supplier Part Number: 71-CRCW0603-10M-E3; Manufacturer Part Number: CRCW060310M0FKEA; RoHS: Yes; Category: Chip SMD Resistors; Stock: 48064; Pricing: 1=0,1, 10=0,017, 50=0,017, 100=0,01, 1000=0,007, 10000=0,003 (USD); Case/Package: 0603; Weight: 7.1E-05oz; Case Code (Imperial): 0603; Case Code (Metric): 1608; Contact Plating: Tin; Min Operating Temperature: -55°C; Max Operating Temperature: 155°C; Resistor Type: Thick Film; Tolerance: 1%; Packaging: Tape and Reel; Package Quantity: 5000; Termination: SMD/SMT; Working Voltage: 75V; Number of Terminations: 2; Features: Automotive AEC-Q200; Series: CRCW; Max Power Dissipation: 100mW; Resistance Tolerance: 1%; Technology: THICK FILM; Construction: Rectangular; Voltage Rating (DC): 75V; Length: 1.55mm; Width: 0.85mm; Height: 0.45mm; Depth: 0.85mm; Ratings: AEC-Q200; Radiation Hardening: No; Lead Free: 5697LeadFree; Military Standard: Not; RoHS Compliant: Yes; Reach SVHC Compliant: Unknown; ComponentLink1URL: https://datasheet.ciiva.com/11808/0900766b80d98afc-11808549.pdf?src-supplier=Rs; ComponentLink1Description: https://datasheet.ciiva.com/11808/0900766b80d98afc-11808549.pdf?src-supplier=Rs; ComponentLink2URL: https://datasheet.ciiva.com/7673/1720486-7673454.pdf?src-supplier=Element14; ComponentLink2Description: https://datasheet.ciiva.com/7673/1720486-7673454.pdf?src-supplier=Element14; ComponentLink3URL: https://datasheet.ciiva.com/26314/fld-crcw-e3-data-en-26314629.pdf?src-supplier=Distrelec; ComponentLink3Description: https://datasheet.ciiva.com/26314/fld-crcw-e3-data-en-26314629.pdf?src-supplier=Distrelec; ComponentLink4URL: https://datasheet.ciiva.com/7673/1697337-7673286.pdf?src-supplier=Element14; ComponentLink4Description: https://datasheet.ciiva.com/7673/1697337-7673286.pdf?src-supplier=Element14; ComponentLink5URL: https://datasheet.ciiva.com/16786/70201119-16786489.pdf?src-supplier=Allied+Electronics; ComponentLink5Description: https://datasheet.ciiva.com/16786/70201119-16786489.pdf?src-supplier=Allied+Electronics; ComponentLink6URL: https://datasheet.ciiva.com/5543/dcrcwe3-109170-5543450.pdf?src-supplier=Mouser; ComponentLink6Description: https://datasheet.ciiva.com/5543/dcrcwe3-109170-5543450.pdf?src-supplier=Mouser; ComponentLink7URL: https://datasheet.ciiva.com/3256/dcrcwe3-3256952.pdf?src-supplier=Avnet; ComponentLink7Description: https://datasheet.ciiva.com/3256/dcrcwe3-3256952.pdf?src-supplier=Avnet; ComponentLink8URL: https://datasheet.ciiva.com/16200/dcrcwe3-16200110.pdf?src-supplier=Future+Electronics; ComponentLink8Description: https://datasheet.ciiva.com/16200/dcrcwe3-16200110.pdf?src-supplier=Future+Electronics
R95-R97 R100 = R_1.2K_%5_1W_2512: Res Thick Film 2512 1.2K Ohm 5% 1W ±200ppm/°C Molded SMD SMD Blister T/R; Manufacturer: Vishay; Voltage Rating (DC): 500V; Supplier: Mouser; Supplier Part Number: 71-CRCW2512J-1.2K-E3; Manufacturer Part Number: CRCW25121K20JNEG; RoHS: Yes; Category: Chip SMD Resistors; Stock: 9658; Pricing: 1=0,32, 10=0,116, 50=0,116, 100=0,074, 1000=0,049, 10000=0,037 (USD); Lead Free: 5697LeadFree; ComponentLink1URL: https://datasheet.ciiva.com/16435/dcrcwe3-16435709.pdf?src-supplier=Future+Electronics; ComponentLink1Description: https://datasheet.ciiva.com/16435/dcrcwe3-16435709.pdf?src-supplier=Future+Electronics; ComponentLink2URL: https://datasheet.ciiva.com/2478/dcrcwe3-2478879.pdf?src-supplier=Digikey; ComponentLink2Description: https://datasheet.ciiva.com/2478/dcrcwe3-2478879.pdf?src-supplier=Digikey; ComponentLink3URL: https://datasheet.ciiva.com/2478/dcrcwe3-2478880.pdf?src-supplier=Digikey; ComponentLink3Description: https://datasheet.ciiva.com/2478/dcrcwe3-2478880.pdf?src-supplier=Digikey; ComponentLink4URL: https://datasheet.ciiva.com/2478/dcrcwe3-2478881.pdf?src-supplier=Digikey; ComponentLink4Description: https://datasheet.ciiva.com/2478/dcrcwe3-2478881.pdf?src-supplier=Digikey; ComponentLink5URL: https://datasheet.ciiva.com/9105/dcrcwe3-9105484.pdf?src-supplier=Avnet; ComponentLink5Description: https://datasheet.ciiva.com/9105/dcrcwe3-9105484.pdf?src-supplier=Avnet; ComponentLink6URL: https://datasheet.ciiva.com/7777/1533075-7777606.pdf?src-supplier=Element14; ComponentLink6Description: https://datasheet.ciiva.com/7777/1533075-7777606.pdf?src-supplier=Element14; ComponentLink7URL: https://datasheet.ciiva.com/5541/dcrcwe3-109170-5541887.pdf?src-supplier=Mouser; ComponentLink7Description: https://datasheet.ciiva.com/5541/dcrcwe3-109170-5541887.pdf?src-supplier=Mouser
R98 R99 = R_0.001OHM_%1_1.5W_2010: Res Metal Foil 2010 0.001 Ohm 1% 1.5W ±50ppm/°C Molded SMD SMD Plastic T/R; Manufacturer: Stackpole Electronics; Supplier: Mouser; Supplier Part Number: 708-CSNL2010FT1L00; Manufacturer Part Number: CSNL2010FT1L00; RoHS: Yes; Category: Chip SMD Resistors; Stock: 25876; Pricing: 1=0,56, 10=0,382, 50=0,382, 100=0,316, 1000=0,193, 10000=0,177 (USD); ComponentLink1URL: https://www.seielect.com/catalog/sei-csnl.pdf?src-supplier=Digikey; ComponentLink1Description: https://www.seielect.com/catalog/sei-csnl.pdf?src-supplier=Digikey; ComponentLink2URL: https://www.seielect.com/catalog/SEI-Packaging.pdf?src-supplier=Digikey; ComponentLink2Description: https://www.seielect.com/catalog/SEI-Packaging.pdf?src-supplier=Digikey; ComponentLink3URL: https://www.seielect.com/Catalog/SEI-CSNL.pdf?src-supplier=Avnet; ComponentLink3Description: https://www.seielect.com/Catalog/SEI-CSNL.pdf?src-supplier=Avnet
R102-R104 = R_620OHM_%5_1/10W_0603: SMD Chip Resistor, 620 Ohm, ± 5%, 100 mW, 0603 [1608 Metric], Thick Film, General Purpose; Manufacturer: Vishay Dale; Supplier: Mouser; Supplier Part Number: 71-CRCW0603J-620-E3; Manufacturer Part Number: CRCW0603620RJNEA; RoHS: Yes; Category: Chip SMD Resistors; Stock: 82648; Pricing: 1=0,1, 10=0,016, 50=0,016, 100=0,009, 1000=0,007, 10000=0,005 (USD); ComponentLink1URL: https://datasheet.ciiva.com/3257/dcrcwe3-3257798.pdf?src-supplier=Avnet; ComponentLink1Description: https://datasheet.ciiva.com/3257/dcrcwe3-3257798.pdf?src-supplier=Avnet; ComponentLink2URL: https://datasheet.ciiva.com/3257/dcrcwe3-3257799.pdf?src-supplier=Avnet; ComponentLink2Description: https://datasheet.ciiva.com/3257/dcrcwe3-3257799.pdf?src-supplier=Avnet; ComponentLink3URL: https://datasheet.ciiva.com/16202/dcrcwe3-16202431.pdf?src-supplier=Future+Electronics; ComponentLink3Description: https://datasheet.ciiva.com/16202/dcrcwe3-16202431.pdf?src-supplier=Future+Electronics; ComponentLink4URL: https://datasheet.ciiva.com/2512/dcrcwe3-2512009.pdf?src-supplier=Digikey; ComponentLink4Description: https://datasheet.ciiva.com/2512/dcrcwe3-2512009.pdf?src-supplier=Digikey; ComponentLink5URL: https://datasheet.ciiva.com/2512/dcrcwe3-2512010.pdf?src-supplier=Digikey; ComponentLink5Description: https://datasheet.ciiva.com/2512/dcrcwe3-2512010.pdf?src-supplier=Digikey; ComponentLink6URL: https://datasheet.ciiva.com/2512/dcrcwe3-2512011.pdf?src-supplier=Digikey; ComponentLink6Description: https://datasheet.ciiva.com/2512/dcrcwe3-2512011.pdf?src-supplier=Digikey
R105 = R_100OHM_%5_1/10W_0603: SMD Chip Resistor, 100 Ohm, ± 5%, 100 mW, 0603 [1608 Metric], Thick Film, General Purpose; Manufacturer: Vishay Dale; Temperature Coefficient: 200ppm/°C; Voltage Rating: 75V; Power Rating: 100mW; Supplier: Mouser; Supplier Part Number: 71-CRCW0603J-100-E3; Manufacturer Part Number: CRCW0603100RJNEA; RoHS: Yes; Category: Chip SMD Resistors; Stock: 90610; Pricing: 1=0,1, 10=0,028, 50=0,028, 100=0,011, 1000=0,005, 10000=0,003 (USD); Case/Package: 0603; Contact Plating: Tin; Weight: 7.1E-05oz; Case Code (Imperial): 0603; Case Code (Metric): 1608; Min Operating Temperature: -55°C; Max Operating Temperature: 155°C; Tolerance: 5%; Packaging: Tape and Reel; Package Quantity: 5000; Resistor Type: Thick Film; Number of Terminations: 2; Termination: SMD/SMT; Max Power Dissipation: 100mW; Features: Automotive AEC-Q200; Series: CRCW; Resistance Tolerance: 5%; Construction: Rectangular; Length: 1.55mm; Width: 0.85mm; Height: 0.45mm; Depth: 0.85mm; Ratings: AEC-Q200; Radiation Hardening: No; Military Standard: Not; RoHS Compliant: Yes; Reach SVHC Compliant: Unknown; Lead Free: 5697LeadFree; ComponentLink1URL: https://datasheet.ciiva.com/26944/getdatasheetpartid-45824-26944476.pdf?src-supplier=Verical; ComponentLink1Description: https://datasheet.ciiva.com/26944/getdatasheetpartid-45824-26944476.pdf?src-supplier=Verical; ComponentLink2URL: https://datasheet.ciiva.com/2461/dcrcwe3-2461977.pdf?src-supplier=Digikey; ComponentLink2Description: https://datasheet.ciiva.com/2461/dcrcwe3-2461977.pdf?src-supplier=Digikey; ComponentLink3URL: https://datasheet.ciiva.com/16755/70201119-16755598.pdf?src-supplier=Allied+Electronics; ComponentLink3Description: https://datasheet.ciiva.com/16755/70201119-16755598.pdf?src-supplier=Allied+Electronics; ComponentLink4URL: https://datasheet.ciiva.com/16214/dcrcwe3-16214053.pdf?src-supplier=Future+Electronics; ComponentLink4Description: https://datasheet.ciiva.com/16214/dcrcwe3-16214053.pdf?src-supplier=Future+Electronics; ComponentLink5URL: https://datasheet.ciiva.com/28621/1912744-28621371.pdf?src-supplier=Element14; ComponentLink5Description: https://datasheet.ciiva.com/28621/1912744-28621371.pdf?src-supplier=Element14; ComponentLink6URL: https://datasheet.ciiva.com/2461/dcrcwe3-2461978.pdf?src-supplier=Digikey; ComponentLink6Description: https://datasheet.ciiva.com/2461/dcrcwe3-2461978.pdf?src-supplier=Digikey; ComponentLink7URL: https://datasheet.ciiva.com/2461/dcrcwe3-2461979.pdf?src-supplier=Digikey; ComponentLink7Description: https://datasheet.ciiva.com/2461/dcrcwe3-2461979.pdf?src-supplier=Digikey; ComponentLink8URL: https://datasheet.ciiva.com/16786/70201119-16786717.pdf?src-supplier=Allied+Electronics; ComponentLink8Description: https://datasheet.ciiva.com/16786/70201119-16786717.pdf?src-supplier=Allied+Electronics
TP18-TP26 TP29-TP32 = TP_PC_TEST_POİNT: TEST POINT, PCB, THROUGH HOLE; Product R; Range: -; Connector Colour: Black; Mounting: Through Hole; Manufacturer: Keystone Electronics; Gender: 30Gender; Inside Diameter: 1.78mm; Supplier: Future Electronics; Supplier Part Number: 5322706; Manufacturer Part Number: 5011; RoHS: Yes; Category: Connectors; Stock: 212621; Pricing: 1=0,169, 200=0,164, 500=0,159, 1250=0,154, 3000=0,144 (USD); Length: 11.3mm; Lead Free: 5697LeadFree; ComponentLink1URL: https://datasheet.ciiva.com/11744/0900766b8009b7c7-11744935.pdf?src-supplier=Rs; ComponentLink1Description: https://datasheet.ciiva.com/11744/0900766b8009b7c7-11744935.pdf?src-supplier=Rs; ComponentLink2URL: https://datasheet.ciiva.com/1454/1718230-1454834.pdf?src-supplier=Element14; ComponentLink2Description: https://datasheet.ciiva.com/1454/1718230-1454834.pdf?src-supplier=Element14; ComponentLink3URL: https://datasheet.ciiva.com/46412/1703983-46412138.pdf?src-supplier=Element14; ComponentLink3Description: https://datasheet.ciiva.com/46412/1703983-46412138.pdf?src-supplier=Element14; ComponentLink4URL: https://datasheet.ciiva.com/16351/m60-2p60-16351093.pdf?src-supplier=Future+Electronics; ComponentLink4Description: https://datasheet.ciiva.com/16351/m60-2p60-16351093.pdf?src-supplier=Future+Electronics; ComponentLink5URL: https://datasheet.ciiva.com/2917/5011-2917635.pdf?src-supplier=Digikey; ComponentLink5Description: https://datasheet.ciiva.com/2917/5011-2917635.pdf?src-supplier=Digikey
TP27 TP28 = TP_CONN_3POS_2.54MM: PEC Series Single Row 3 Position 2.54 mm Straight Breakaway Header; Manufacturer: Sullins; Supplier: Digikey; Supplier Part Number: S1012E-03-ND; Manufacturer Part Number: PEC03SAAN; RoHS: Yes; Category: Connectors; Stock: 17576; Pricing: 1=0,18, 10=0,155, 100=0,1193, 500=0,10092, 1000=0,08257, 5000=0,0734, 10000=0,06652 (USD); ComponentLink1URL: http://www.sullinscorp.com/catalogs/97_Page78-79_HEADER_.100_2.54mm_MALE_BREAKAWAY.pdf?src-supplier=Future+Electronics; ComponentLink1Description: http://www.sullinscorp.com/catalogs/97_Page78-79_HEADER_.100_2.54mm_MALE_BREAKAWAY.pdf?src-supplier=Future+Electronics; ComponentLink2URL: https://s3.amazonaws.com/catalogspreads-pdf/PAGE112-113%20.100%20MALE%20HDR.pdf?src-supplier=Digikey; ComponentLink2Description: https://s3.amazonaws.com/catalogspreads-pdf/PAGE112-113%20.100%20MALE%20HDR.pdf?src-supplier=Digikey; ComponentLink3URL: https://datasheet.octopart.com/PEC03SAAN-Sullins-datasheet-41399297.pdf?src-supplier=Future+Electronics; ComponentLink3Description: https://datasheet.octopart.com/PEC03SAAN-Sullins-datasheet-41399297.pdf?src-supplier=Future+Electronics
U3 = FET_DRİVER_16TSTOP: HIGH-SIDEN-CHFETDRVR16TSSOP; Manufacturer: Texas Instruments; Supplier: Digikey; Supplier Part Number: 296-43273-1-ND; Manufacturer Part Number: BQ76200PWR; RoHS: Yes; Category: Battery Management; Stock: 3882; Pricing: 1=2,71, 10=2,438, 25=2,3004, 100=1,9598, 250=1,84024, 500=1,6102, 1000=1,33416 (USD); ComponentLink1URL: http://www.ti.com/lit/gpn/bq76200?src-supplier=Mouser; ComponentLink1Description: http://www.ti.com/lit/gpn/bq76200?src-supplier=Mouser; ComponentLink2URL: http://www.ti.com/lit/ds/symlink/bq76200.pdf?src-supplier=Digikey; ComponentLink2Description: http://www.ti.com/lit/ds/symlink/bq76200.pdf?src-supplier=Digikey